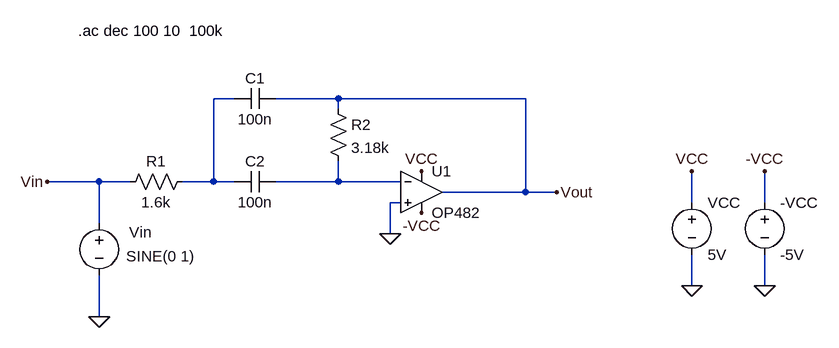
[diagram p0: schematic Draft3.asc]
Draft3.asc, the LTspice schematic file:
Version 4
SHEET 1 1136 680
WIRE 240 144 208 144
WIRE 400 144 304 144
WIRE 688 144 400 144
WIRE 400 160 400 144
WIRE 32 272 -48 272
WIRE 80 272 32 272
WIRE 208 272 208 144
WIRE 208 272 160 272
WIRE 240 272 208 272
WIRE 400 272 400 240
WIRE 400 272 304 272
WIRE 496 272 400 272
WIRE 688 288 688 144
WIRE 688 288 560 288
WIRE 736 288 688 288
WIRE 496 304 480 304
WIRE 944 304 944 256
WIRE 1056 304 1056 256
WIRE 32 336 32 272
WIRE 480 352 480 304
WIRE 944 432 944 384
WIRE 1056 432 1056 384
WIRE 32 480 32 416
FLAG 32 480 0
FLAG 480 352 0
FLAG 736 288 Vout
FLAG -48 272 Vin
FLAG 944 432 0
FLAG 1056 432 0
FLAG 944 256 VCC
FLAG 1056 256 -VCC
FLAG 528 320 -VCC
FLAG 528 256 VCC
SYMBOL Voltage 32 320 R0
WINDOW 0 46 30 Left 2
WINDOW 3 42 67 Left 2
SYMATTR InstName Vin
SYMATTR Value SINE(0 1)
SYMATTR Value2 AC 1
SYMBOL Res 176 256 R90
WINDOW 0 0 56 VBottom 2
WINDOW 3 32 56 VTop 2
SYMATTR InstName R1
SYMATTR Value 1.6k
SYMBOL Cap 304 128 R90
WINDOW 0 0 32 VBottom 2
WINDOW 3 32 32 VTop 2
SYMATTR InstName C1
SYMATTR Value 100n
SYMBOL Cap 304 256 R90
WINDOW 0 0 32 VBottom 2
WINDOW 3 32 32 VTop 2
SYMATTR InstName C2
SYMATTR Value 100n
SYMBOL Res 384 144 R0
SYMATTR InstName R2
SYMATTR Value 3.18k
SYMBOL OP482 528 224 R0
SYMATTR InstName U1
SYMBOL Voltage 944 288 R0
SYMATTR InstName VCC
SYMATTR Value 5V
SYMBOL Voltage 1056 288 R0
SYMATTR InstName -VCC
SYMATTR Value -5V
TEXT 0 40 Left 2 !.ac dec 100 10  100k

The netlist it stands for:
* Draft3.asc
Vin Vin 0 SINE(0 1) AC 1
R1 N001 Vin 1.6k
C1 Vout N001 100n
C2 N002 N001 100n
R2 Vout N002 3.18k
* U1: OP482 (symbol OP482 not available, pins judged from their places): In+=0 In-=N002 V+=VCC V-=-VCC OUT=Vout
VCC VCC 0 5V
V§-VCC -VCC 0 -5V
.ac dec 100 10  100k
.backanno
.end